# Altium project Pi5_Powerboard.PrjPcb
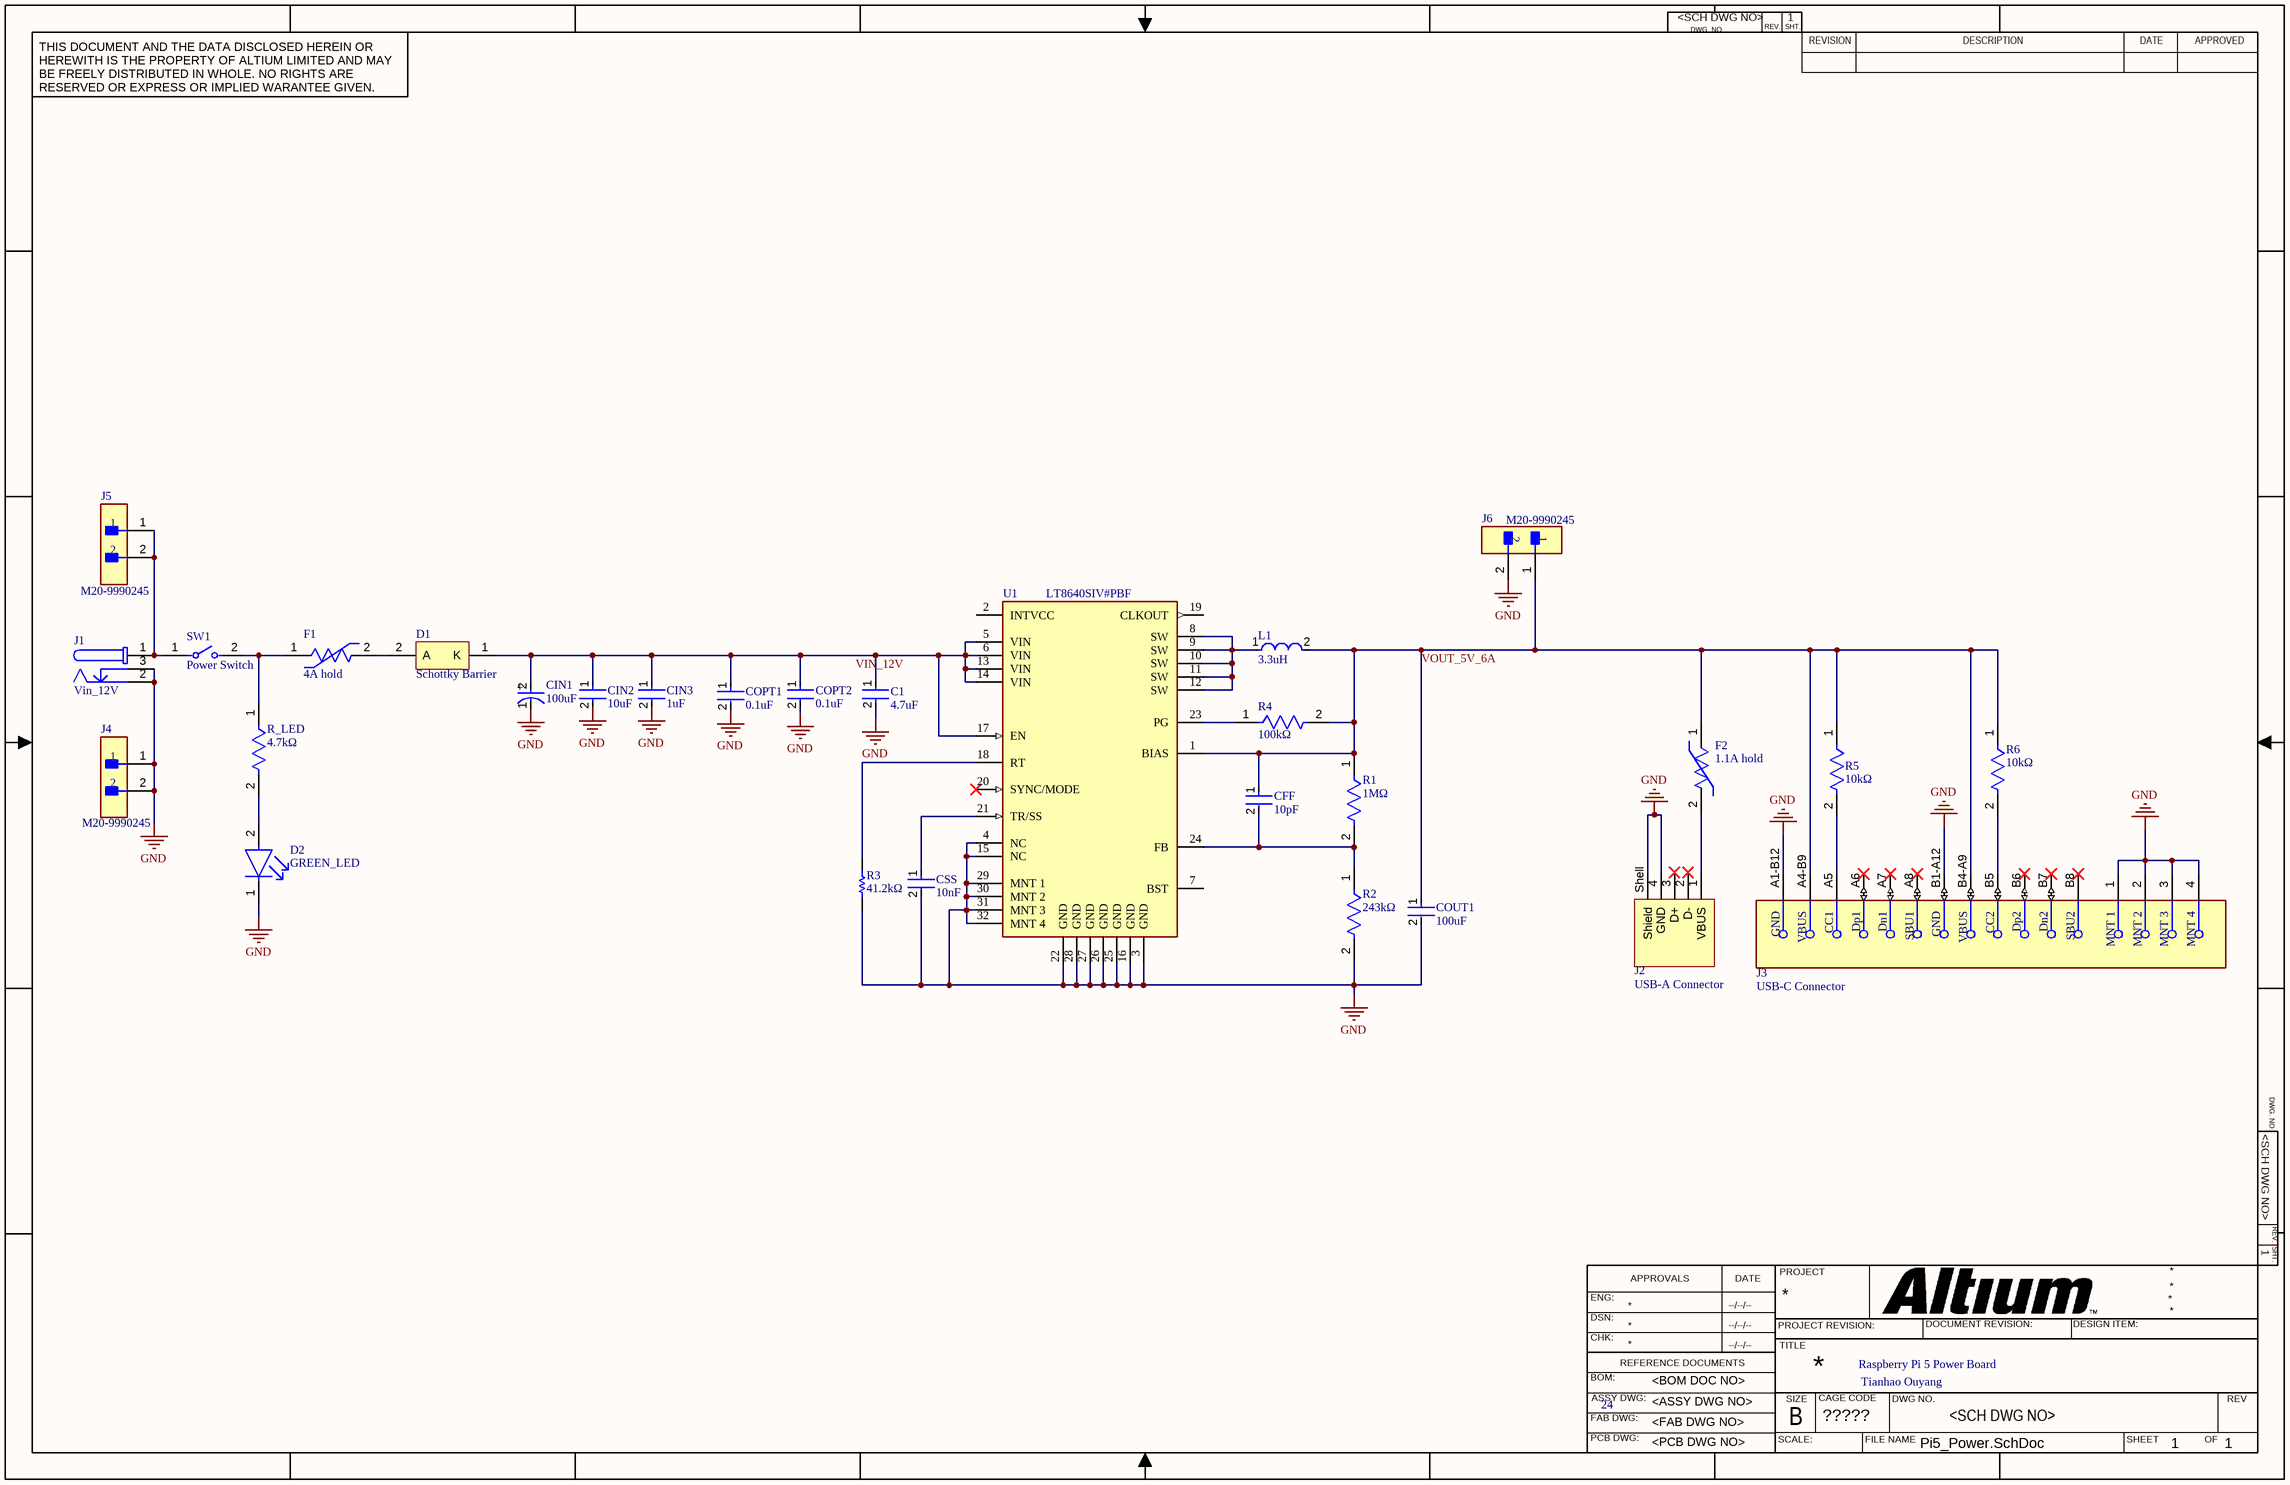
[diagram p0: Pi5_Power.SchDoc]
CAGE_CODE: ?????; CONTRACT_NUMBER: <CONTRACT NO>; DOC_NO_ASSY_DWG: <ASSY DWG NO>; DOC_NO_BOM: <BOM DOC NO>; DOC_NO_FAB_DWG: <FAB DWG NO>; DOC_NO_SCH_DWG: <SCH DWG NO>; PCB_2_DEC_TOL: +/-.01; PCB_3_DEC_TOL: +/-.010; PCB_ANG_TOL: +/-1/2; PCB_ASSEMBLY_NO: <PCB ASSY NO>; PCB_CHECKER: - -----; PCB_CHECKER_APP_DATE: --/--/----; PCB_DESIGNER: - -----; PCB_DESIGNER_APP_DATE: --/--/----; PCB_DWG_NO: <PCB DWG NO>; PCB_ENGINEER: - -----; PCB_ENGINEER_APP_DATE: --/--/----; PCB_PART_NUMBER: <PCB PN>; PCB_REV: A; SCH_REV: A
1 sheet, 29 parts. Net scope: global (net labels, ports and power ports of the same name join across sheets).
Board file: PCB1.PcbDoc

## Sheet Pi5_Power.SchDoc
size 431 x 279 mm; SheetNumber: 1; SheetTotal: 1; ENG_APP_DATE: --/--/--; DSN_APP_DATE: --/--/--; CHK_APP_DATE: --/--/--

### Parts
C1  4.7uF  [FP-GCM32E-0_3-IPC_B]
CFF  10pF  [FP-C0805C-DN-MFG]
CIN1  100uF  [FP-RAD-TH-D_6_3_0_5-L_11-MFG]
CIN2  10uF  [FP-GRM32-MFG]
CIN3  1uF  [FP-C3216-160-0_2-IPC_B]
COPT1  0.1uF  [FP-C1206C-EB-MFG]
COPT2  0.1uF  [FP-C1206C-EB-MFG]
COUT1  100uF  [FP-GRM32E-0_3-0_2-IPC_B]
CSS  10nF  [FP-C0603C-CF-MFG]
D1  Schottky Barrier  [ONSC-SMC-2-403-03_V]
D2  GREEN_LED  [FP-APHD1608LZGCK-MFG]
F1  4A hold  [FP-2920L400-15MR-MFG]
F2  1.1A hold  [FP-NANOSMDC110F-2-MFG]
J1  Vin_12V  [694108301002]
J2  USB-A Connector  [62900416021]
J3  USB-C Connector  [FP-USB4105-GF-A-MFG]
J4  M20-9990245  [FP-M20-9990245-MFG]
J5  M20-9990245  [FP-M20-9990245-MFG]
J6  M20-9990245  [FP-M20-9990245-MFG]
L1  3.3uH  [FP-IHLP-3232DZ-FP_2_413x5-MFG]
R1  1MΩ  [FP-RMCF0603-IPC_B]
R2  243kΩ  [FP-RMCF0603-IPC_A]
R3  41.2kΩ  [RESC1608X55X30ML20T10]
R4  100kΩ  [FP-CRGP0603-IPC_C]
R5  10kΩ  [FP-RC0603-0_55-IPC_C]
R6  10kΩ  [FP-RC0603-0_55-IPC_C]
R_LED  4.7kΩ  [FP-MCT0603-IPC_C]
SW1  Power Switch  [FP-L101011MS02Q-MFG]
U1  LT8640SIV#PBF  [FP-LQFN-24-05-08-1511-MFG]

### Nets
GND: C1.2 CIN1.1(C) CIN2.2 CIN3.2 COPT1.2 COPT2.2 COUT1.2 CSS.2 D2.1(C) J1.2 J1.3 J2.4(GND) J2.Shell(Shield) J3.1(MNT_1) J3.2(MNT_2) J3.3(MNT_3) J3.4(MNT_4) J3.A1-B12(GND) J3.B1-A12(GND) J4.1 J4.2 J6.2 R2.2 R3.1 U1.3(GND) U1.4(NC) U1.15(NC) U1.16(GND) U1.22(GND) U1.25(GND) U1.26(GND) U1.27(GND) U1.28(GND) U1.29(MNT_1) U1.30(MNT_2) U1.31(MNT_3) U1.32(MNT_4)
VIN_12V: C1.1 CIN1.2(A) CIN2.1 CIN3.1 COPT1.1 COPT2.1 D1.1(K) U1.5(VIN) U1.6(VIN) U1.13(VIN) U1.14(VIN) U1.17(EN)
VOUT_5V_6A: CFF.1 COUT1.1 F2.1 J3.A4-B9(VBUS) J3.B4-A9(VBUS) J6.1 L1.2 R1.1 R4.2 R5.1 R6.1 U1.1(BIAS)
NetCFF_2: CFF.2 R1.2 R2.1 U1.24(FB)
NetCSS_1: CSS.1 U1.21(TR/SS)
NetD1_2: D1.2(A) F1.2
NetD2_2: D2.2(A) R_LED.2
NetF1_1: F1.1 R_LED.1 SW1.2
NetF2_2: F2.2 J2.1(VBUS)
NetJ1_1: J1.1 J5.1 J5.2 SW1.1
NetJ3_A5: J3.A5(CC1) R5.2
NetJ3_B5: J3.B5(CC2) R6.2
NetL1_1: L1.1 U1.8(SW) U1.9(SW) U1.10(SW) U1.11(SW) U1.12(SW)
NetR3_2: R3.2 U1.18(RT)
NetR4_1: R4.1 U1.23(PG)

Not connected (* = marked no-connect by the designer): J2 2(D-)* 3(D+)*; J3 A6(Dp1)* A7(Dn1)* A8(SBU1)* B6(Dp2)* B7(Dn2)* B8(SBU2)*; U1 2(INTVCC) 7(BST) 19(CLKOUT) 20(SYNC/MODE)*

### Notes on the sheet
- Raspberry Pi 5 Power Board
- 24
- Tianhao Ouyang
- DWG. NO.
- REV.
- SHT.
- THIS DOCUMENT AND THE DATA DISCLOSED HEREIN OR HEREWITH IS THE PROPERTY OF ALTIUM LIMITED AND MAY BE FREELY DISTRIBUTED IN WHOLE. NO RIGHTS ARE RESERVED OR EXPRESS OR IMPLIED WARANTEE GIVEN.
- REVISION
- DESCRIPTION
- DATE
- APPROVED
- ENG:
- APPROVALS
- PROJECT
- DSN:
- CHK:
- REFERENCE DOCUMENTS
- PROJECT REVISION:
- TITLE
- DOCUMENT REVISION:
- DESIGN ITEM:
- BOM:
- FAB DWG:
- PCB DWG:
- ASSY DWG:
- SCALE:
- SIZE
- B
- CAGE CODE
- FILE NAME
- DWG NO.
- SHEET
- OF
- REV
- (in symbol CMP-05427-000856-1) +

### Library data of the parts
C1 = CMP-06035-005584-1: Ceramic Capacitor for Automotive 4.7uF ±10% 50VDC X7R 1210 Embossed T/R; Voltage: 50V; Tolerance: 20%; Lead Free: Lead Free; Max Operating Temperature: 125°C; Mount: Surface Mount; Height: 2.5mm; Termination: SMD/SMT; Length: 3.2mm; Capacitance: 4.7uF; Ratings: AEC-Q200; Dielectric: X7R; Packaging: Tape and Reel; Depth: 2.5mm; Case Code (Imperial): 1210; Width: 0.098inch; Package Quantity: 1; Voltage Rating: 50V; Case/Package: 1210; Case Code (Metric): 3225; Radiation Hardening: No; Min Operating Temperature: -55°C; Voltage Rating (DC): 50V; Thickness: 0.106inch
CFF = CMP-03020-028919-1: C0805 10 pF C0G 30ppm/°C 5.00% 250 V; Manufacturer Part Number: C0805C100JAGACTU; Manufacturer: KEMET; Tolerance: 0.05; Voltage Rating: 250 V; Temperature Range High: +125°C; Temperature: -55°C to +125°C; Temperature Characteristic: C0G; Height: 0.88mm; Package: C0805C-DN; Automotive: No; Capacitance: 10 pF; Device Class L1: Passive Components; RoHS: TRUE; Value: 10 pF; Ipc Land Pattern Name: CAPC200125X78; Device Class L2: Capacitors; ComponentLink2Description: Datasheet; Temperature Range Low: -55°C; ComponentLink2URL: https://content.kemet.com/datasheets/KEM_C1003_C0G_SMD.pdf; Lead Free: Yes; Temperature Coefficient: 30ppm/°C; Octopart: https://octopart.com/c0805c100jagactu-kemet-88373098; Material: Ceramic; Category: Cap; Device Class L3: Ceramic Capacitors
CIN1 = CMP-05427-000856-1: Aluminum Electrolytic Capacitors (Radial Lead Type) 100uF ±20% 25V; Lead Diameter: 0.5mm; Polarity: Polar; Ripple Current: 455mA; Impedance: 130mR; Life (Hours): 2000Hour; Length: 11mm; Min Operating Temperature: -40°C; Termination: Radial; Diameter: 6mm; Lead Pitch: 5mm; Tolerance: 20%; Capacitance: 100uF; Case/Package: Radial; Voltage Rating (DC): 25V; Height - Seated (Max): 0.5inch; RoHS Compliant: Yes; Series: FM; Package Quantity: 2000; Voltage Rating: 25V; Max Operating Temperature: 105°C; Mount: Through Hole; ESR (Equivalent Series Resistance): 130mR; Packaging: Tape and Reel
CIN2 = CMP-2000-05261-2: CAP CER 10UF 50V X7R 1210; Manufacturer Part Number: GRM32ER71H106KA12L; Manufacturer: Murata; Tolerance: 10%; Temperature Coefficient: 15%; Voltage Rating: 50V; Temperature Characteristic: X7R; Value: 10uF; ComponentLink2Description: Datasheet; Device Class L1: Passive Components; Lead Free: Yes; Temperature Range High: +125°C; Category: Cap; ComponentLink2URL: https://search.murata.co.jp/Ceramy/image/img/A01X/G101/ENG/GRM32ER71H106KA12-01.pdf; Device Class L2: Capacitors; Material: Ceramic; Package: GRM32; Mouser Description: 1210 10 uF 50 V ±10% Tolerance X7R SMT Multilayer Ceramic Capacitor; Capacitance: 10uF; Octopart: https://octopart.com/grm32er71h106ka12l-murata-10470987; Digikey Description: CAP CER 10UF 50V X7R 1210; Height: 2.7mm; Temperature: -55°C to +125°C; Temperature Range Low: -55°C; RoHS: TRUE; Device Class L3: Ceramic Capacitors; Automotive: No
CIN3 = CMP-2000-05402-2: Multilayer Ceramic Capacitors 1uF ±10% 50V X7R SMD 1206; Voltage: 25V; Voltage Rating (DC): 50V; Dielectric: X7R; Number of Pins: 2; Length: 0.126inch; Case Code (Imperial): 1206; Capacitance: 1uF; Package Quantity: 2000; Min Operating Temperature: -55°C; Lead Free: Lead Free; Radiation Hardening: No; Termination: SMD/SMT; Case Code (Metric): 3216; Series: C; Weight: 0.000571oz; REACH SVHC: No SVHC; Tolerance: 10%; Max Operating Temperature: 125°C; RoHS Compliant: Yes; Mount: Surface Mount; Dielectric Material: Ceramic; Packaging: Tape and Reel; Thickness: 0.071inch; Height: 1.6mm; Resistor Type: Ceramic; Width: 0.063inch; Voltage Rating: 50V; Depth: 1.6mm; Case/Package: 1206
COPT1 COPT2 = CMP-1037-04228-2: CAP CER 0.1UF 250V X7R 1206; Manufacturer Part Number: C1206C104JARACTU; Manufacturer: KEMET; Temperature Coefficient: 15%; Value: 0.10 μF; Automotive Grade: Grade 0; Tolerance: 0.05; Package: C1206C-EB; Device Class L2: Capacitors; Material: Ceramic; Temperature: -55°C to +150°C; Category: Cap; Temperature Characteristic: X7R; RoHS: TRUE; Automotive: Yes; Voltage Rating: 250 V; Octopart: https://octopart.com/c1206c104jaractu-kemet-16430893; Device Class L1: Passive Components; Lead Free: Yes; Digikey Description: CAP CER 0.1UF 250V X7R 1206; Height: 0.88mm; ComponentLink2URL: https://content.kemet.com/datasheets/KEM_C1007_X8R_ULTRA_150C_SMD.pdf; Device Class L3: Ceramic Capacitors; ComponentLink2Description: Datasheet; Ipc Land Pattern Name: CAPC320160X78; Temperature Range Low: -55°C; Temperature Range High: +150°C; Capacitance: 0.10 μF
COUT1 = CMP-06035-040230-1: Chip Multilayer Ceramic Capacitors for General Purpose, 1210, 100uF, X5R, 15%, 20%, 10V; Package Quantity: 4000; Voltage Rating: 10V; Packaging: Tape and Reel; Length: 0.126inch; Voltage Rating (DC): 10V; Tolerance: 20%; Case Code (Imperial): 1210; Max Operating Temperature: 85°C; Capacitance: 100uF; Dielectric: X5R; Case/Package: 1210; Mount: Surface Mount; Termination: SMD/SMT; Min Operating Temperature: -55°C; Thickness: 0.106inch; Case Code (Metric): 3225; Width: 0.098inch; Weight: 0.00388oz
CSS = CMP-03020-015732-1: C0603 10,000 pF X7R 30ppm/°C 10.00% 25 V; Manufacturer Part Number: C0603C103K3RAC7411; Manufacturer: KEMET; Tolerance: 0.1; Voltage Rating: 25 V; Automotive Grade: Grade 1; Height: 0.87mm; Value: 10,000 pF; Mouser Description: Cap Ceramic 0.01uF 25V X7R 10% SMD 0603 125°C Paper T/R; ComponentLink2URL: https://api.kemet.com/component-edge/download/datasheet/C0603C100J5GACAUTO.pdf; Temperature Range High: +125°C; Temperature Range Low: -55°C; Automotive: Yes; RoHS: TRUE; Temperature Coefficient: 30ppm/°C; ComponentLink2Description: Datasheet; Device Class L2: Capacitors; Package: C0603C-CF; Category: Cap; Capacitance: 10,000 pF; Lead Free: Yes; Device Class L1: Passive Components; Temperature: -55°C to +125°C; Material: Ceramic; Octopart: https://octopart.com/c0603c103k3rac7411-kemet-55455931; Device Class L3: Ceramic Capacitors; Temperature Characteristic: X7R
D1 = CMP-1055-00390-1: Schottky Power Rectifier, 2-Pin SMC, Pb-Free, Tape and Reel; Manufacturer: On Semiconductor; PartNumber: MBRS540T3G; Configuration: Single; IFSM Max (A): 190; ComponentLink1URL: http://www.onsemi.com/; ComponentLink3URL: http://www.onsemi.com/pub_link/Collateral/403-03.PDF; ComponentLink1Description: Manufacturer URL; PackageVersion: Rev. E, 08/2005; Packing: Tape and Reel; ComponentLink2URL: http://www.onsemi.cn/pub_link/Collateral/MBRS540T3-D.PDF; RoHS: TRUE; DatasheetVersion: Rev. 8; Mounting Technology: Surface Mount; ComponentLink3Description: Package Specification; ComponentLink2Description: Datasheet; PackageDescription: 2-Pin Small Molded Package, J-Bend Lead, Body 5.845 x 6.855 mm; PackageReference: SMC-2-403-03
D2 = CMP-44529-000045-1: LED GREEN CLEAR 1608 SMD; Test Current: 2mA; Dominant Wavelength: 525nm; Lens Color: Colorless; Luminous Intensity: 180mcd; Viewing Angle: 100°; Forward Voltage: 2.65V; Lens Size: 0.7mm; Lens Style: Round; Mount: Surface Mount; Packaging: Tape and Reel; Lens Transparency: Clear; Height: 0.75mm; Case/Package: 0603; Length: 1.6mm; Case Code (Metric): 1608; Width: 0.8mm; Color: Green; Case Code (Imperial): 0603
F1 = CMP-08606-000010-2: PTC RESET FUSE 15V 4A 2920; Max Current Rating: 40A; Time to Trip: 4s; Trip Current: 8A; Approvals: TUV; Min Operating Temperature: -40°C; Packaging: Tape and Reel; Case Code (Metric): 7351; Hold Current: 4A; Max Operating Temperature: 85°C; Case Code (Imperial): 2920; Mount: Surface Mount
F2 = CMP-08606-000043-1: PTC RESET FUSE 6V 1.1A 1206; Manufacturer: Littelfuse; Manufacturer Part Number: NANOSMDC110F-2; Resistance: 0.07-0.2Ω; Trip Time: 0.1s; Trip Current: 2.2A; Value: 0.07-0.2Ω; Current Rating: 100A; Lead Free: Yes; Temperature: to +85°C; Hold Current: 1.1A; ComponentLink2Description: Datasheet; RoHS: TRUE; Package: 0; Device Class L2: PTC Resettable Fuses; Automotive: No; Temperature Range High: +85°C; Octopart: https://octopart.com/nanosmdc110f-2-littelfuse-74215055; Category: Fuse; Voltage Rating: 6V; Height: 0.67mm; ComponentLink2URL: https://www.littelfuse.com/~/media/electronics/datasheets/resettable_ptcs/littelfuse_ptc_nanosmdc_datasheet.pdf.pdf; Ambient Temperature Range Low: -40°C; Device Class L3: unset; Ambient Temperature Range High: +85°C; Device Class L1: Circuit Protection; Digikey Description: PTC RESET FUSE 6V 1.1A 1206
J1 = CMP-1502-00190-4: DC Power Jack Connector WR-DC, Male, Right Angled, THT, 5 A, 24 V; Operating Supply Voltage: 24V; Shielding: Unshielded; Voltage Rating: 30V; Number of Contacts: 3; Insulation Resistance: 100MΩ; Current Rating: 5A; Min Operating Temperature: -40°C; Packaging: Bulk; Connector Type: Power; Housing Material: Polyamide; REACH SVHC: Unknown; Termination: Through Hole; Contact Gender: Female; Mount: Through Hole; RoHS: Compliant; Flammability Rating: UL94 V-0; Height: 11mm; Max Operating Temperature: 85°C; Contact Plating: Tin; Color: Black; Gender: Male; Contact Material: Gold, Tin
J2 = CMP-1502-03240-3: Wr-com; Right Angle Version 2.0; Connector SMT Socket, 30 V AC, 1.5A, 62900; Operating Supply Voltage: 30V; Contact Resistance: 20mΩ; Insulation Resistance: 1GΩ; Connector Type: USB; Number of Contacts: 4; Gender: Receptacle; USB Standard: USB 2.0; Packaging: Cut Tape; Min Operating Temperature: -40°C; REACH SVHC: Unknown; Mount: Horizontal, Surface Mount; Termination: SMD/SMT; Number of Pins: 4; RoHS: Compliant; Current Rating: 1.5A; Length: 14.4mm; Contact Plating: Gold; Features: Shielded; Lead Free: Lead Free; Max Operating Temperature: 105°C; Orientation: Horizontal
J3 = CMP-245163-000001-1: CONN RCPT USB2.0 TYPEC 5A; Manufacturer Part Number: USB4105-GF-A; Manufacturer: GCT; Voltage Rating: 20V; Is Female: yes; Current Rating: 5/6.25/1.25/0.25A; Number Of Contacts: 16; Conn Orientation: Right Angle; Device Class L1: Connectors; Category: Conn; Lead Free: Yes; RoHS: TRUE; Temperature Range High: +85°C; Digikey Description: CONN RCPT USB2.0 TYPEC 5A; Device Class L3: unset; ComponentLink2Description: Datasheet; Package: 0; Usb Standard: USB 2.0; Device Class L2: USB Connectors; Automotive: No; Temperature Range Low: -40°C; Height: 3.46mm; Temperature: -40°C to +85°C; Contact Material: Gold,Nickel; ComponentLink2URL: https://gct.co/files/drawings/usb4105.pdf; Octopart: https://octopart.com/usb4105-gf-a-gct-106627878
J4-J6 = CMP-15831-000105-1: CONN HEADER VERT 2POS 2.54MM; Working Voltage: 750V; Gender: Male; Number of Poles: 2; Current Rating: 3A; Mated Stacking Heights: 16.54mm; Contact Resistance: 25mR; Connector Type: Male Pin; Insulation Resistance: 10GR; Mating Cycles: 300; Voltage: 50V; Flammability Rating: UL94 V-0; Pitch: 2.54mm; Series: M20; Number of Contacts: 2; Height: 0.12inch; Min Operating Temperature: -40°C; Contact Finish - Mating: GOLD; Number of Positions: 2; Number of Rows: 1; Packaging: Bulk; Package Quantity: 1000; Voltage Rating (AC): 750V; Current: 3A; Mount: Through Hole; Case/Package: SIL; Orientation: Straight; Contact Shape: Square; Weight: 0.25lb; Radiation Hardening: No; Fastening Type: Pull; Length: 5.08mm; Depth: 2.54mm; Contact Mating Length: 0.24inch; Housing Material: Nylon; Reach SVHC Compliant: Yes; Insulation Material: Nylon; Color: Black; Width: 0.25inch; Insulation Color: Black; Contact Material: Brass; Contact Type: Male Pin; Termination: Solder; Max Operating Temperature: 105°C; Contact Plating: Gold; Housing Color: Black; Max Current Rating: 3A; Lead Pitch: 2.54mm
L1 = CMP-02424-000510-1: Commercial Inductors, Low DCR Series 3.3uH 10.5A 14.9mΩ 20%; Shielding: Shielded; Test Frequency: 100kHz; Saturation Current: 9.7A; Core Material: Ferrite; DC Resistance (DCR): 14.9mR; Self Resonant Frequency: 22MHz; Length: 8.89mm; Inductance: 3.3uH; Lead Free: Lead Free; Tolerance: 20%; Height: 4mm; Mount: Surface Mount; Termination: SMD/SMT; Package Quantity: 500; Max Operating Temperature: 125°C; Case/Package: 3232; Height - Seated (Max): 0.157inch; Military Standard: Not; Depth: 8.94mm; Width: 8.18mm; Packaging: Tape and Reel; Current Rating: 10.5A; Min Operating Temperature: -55°C; Inductance Tolerance: 20%; Max DC Current: 9.7A; Radiation Hardening: No; Contact Plating: Tin; RMS Current (Irms): 10.5A; Number of Pins: 2
R1 = CMP-26527-006958-1: 1MΩ ±1% 0.1W 0603 Thick Film Chip Resistor AEC-Q200 compliant; Resistance: 1MR; Working Voltage: 75V; Temperature Coefficient: 100ppm/°C; Power Rating: 100mW; Series: RMCF; Case/Package: 0603; Packaging: Tape and Reel; Technology: THICK FILM; Depth: 0.8mm; Contact Plating: Tin; Lead Free: Lead Free; Mount: Surface Mount; Features: Automotive AEC-Q200; Construction: Rectangular; Length: 1.55mm; Tolerance: 1%; Resistor Type: Thick Film; Max Power Dissipation: 100mW; Case Code (Imperial): 0603; Height: 0.022inch; Max Operating Temperature: 155°C; Radiation Hardening: No; Width: 0.031inch; Min Operating Temperature: -55°C; Military Standard: Not; Number of Terminations: 2; Case Code (Metric): 1608; RoHS Compliant: Yes
R2 = CMP-26527-004519-1: 243kΩ ±1% 0.1W 0603 Thick Film Chip Resistor AEC-Q200 compliant; Max Power Dissipation: 100mW; Temperature Coefficient: 100ppm/°C; Resistance: 243kR; Radiation Hardening: No; Case Code (Metric): 1608; Number of Terminations: 2; Case/Package: 0603; Tolerance: 1%; Min Operating Temperature: -55°C; Resistor Type: Thick Film; Packaging: Tape and Reel; Package Quantity: 1; Case Code (Imperial): 0603; Mount: Surface Mount; Contact Plating: Tin; Features: Automotive AEC-Q200; Series: RMCF; Width: 0.031inch; RoHS Compliant: Yes; Length: 0.061inch; Height: 0.022inch; Max Operating Temperature: 155°C
R3 = CMP-2000-01491-1: Part Number: RK73H1JTTD4122F; Manufacturer: KOA Speer
R4 = CMP-03211-000885-1: CRGP 0603 100K 1%; Manufacturer: TE; Manufacturer Part Number: CRGP0603F100K; Power Rating: 0.25W; Voltage Rating: 50V; Tolerance: 0.01; Temperature Coefficient: ±100ppm/°C; Device Class L2: Resistors; Temperature: -55°C to +155°C; Temperature Range High: +155°C; Ambient Temperature Range High: +70°C; Lead Free: Yes; RoHS: TRUE; Octopart: https://octopart.com/crgp0603f100k-te+connectivity-91018719; Digikey Description: CRGP 0603 100K 1%; Automotive: No; ComponentLink2Description: Datasheet; Resistance: 100KΩ; Category: Res; Value: 100KΩ; Ipc Land Pattern Name: RESC16080X45; Device Class L3: Chip SMD Resistors; Composition: Thick Film; Temperature Range Low: -55°C; Height: 0.55mm; Device Class L1: Passive Components; Series: CRGP; Package: CRGP0603; ComponentLink2URL: https://www.te.com/commerce/DocumentDelivery/DDEController?Action=srchrtrv&DocNm=9-1773463-9&DocType=DS&DocLang=English
R5 R6 = CMP-2100-03664-2: RES 10K OHM 1% 1/10W 0603; Voltage Rating: 75V; Voltage Rating (DC): 50V; Resistance: 10kR; Power Rating: 100mW; Temperature Coefficient: 100ppm/°C; Depth: 0.8mm; Termination: SMD/SMT; Resistor Type: Thick Film; Series: RC; Construction: Rectangular; Features: Moisture Resistant; Packaging: Tape and Reel; Min Operating Temperature: -55°C; Number of Terminations: 2; Lead Pitch: 0.3mm; RoHS Compliant: Yes; Case/Package: 0603; Resistance Tolerance: 1%; Military Standard: Not; Weight: 7.1E-05oz; Number of Pins: 2; Tolerance: 1%; Length: 1.6mm; Case Code (Imperial): 0603; Lead Free: Lead Free; Width: 0.8mm; Max Power Dissipation: 100mW; Height: 0.45mm; Max Operating Temperature: 155°C; Case Code (Metric): 1608; Size Code: 0603
R_LED = CMP-02407-000304-1: RES SMD 100 OHM 1% 1/8W 0603; Resistance: 4.7kR; Voltage Rating (DC): 75V; Tolerance: 0.1%; Temperature Coefficient: 25ppm/°C; Max Power Dissipation: 125mW; Depth: 0.85mm; Composition: Thin Film; Min Operating Temperature: -55°C; Number of Terminations: 2; Package Quantity: 1; REACH SVHC: No SVHC; Contact Plating: Tin; Case Code (Metric): 1608; Case Code (Imperial): 0603; Max Operating Temperature: 155°C; Military Standard: Not; Case/Package: 0603; Voltage Rating: 75V; Radiation Hardening: No; Width: 0.033inch; Packaging: Tape and Reel; Features: Automotive AEC-Q200; Height: 0.45mm; Power Rating: 125mW; Length: 1.55mm
SW1 = CMP-10038-000020-1: SWITCH SLIDE SPST 4A 125V; Actuator Length: 5.08mm; Actuator Type: Standard; Contact Current Rating: 2A; Electrical Life: 10000Cycles; Switch Function: On-Off; Voltage Rating (DC): 28V; Actuator Color: Black; Actuator Material: Nylon; Switch Travel: 3.81mm; Max Voltage Rating (AC): 250V; Max Current Rating: 4A; Contact Plating: Silver; Throw Configuration: SPST; Depth: 10.8mm; Package Quantity: 1; Length: 19.1mm; Current Rating: 4A; Max Operating Temperature: 65°C; Orientation: Straight; Radiation Hardening: No; Termination: PC Pins; Max Voltage Rating (DC): 125V; Series: L; Min Operating Temperature: -30°C; Contact Material: Copper; Lead Free: Lead Free; Mount: Through Hole; RoHS Compliant: Yes; Voltage Rating (AC): 125V; Packaging: Bulk; Housing Material: Nylon
U1 = CMP-09139-000487-1: IC REG BUCK ADJUSTABLE 6A 24LQFN; RoHS Compliant: Yes